# Altium project Pedal_Codec_4x4.PrjPcb
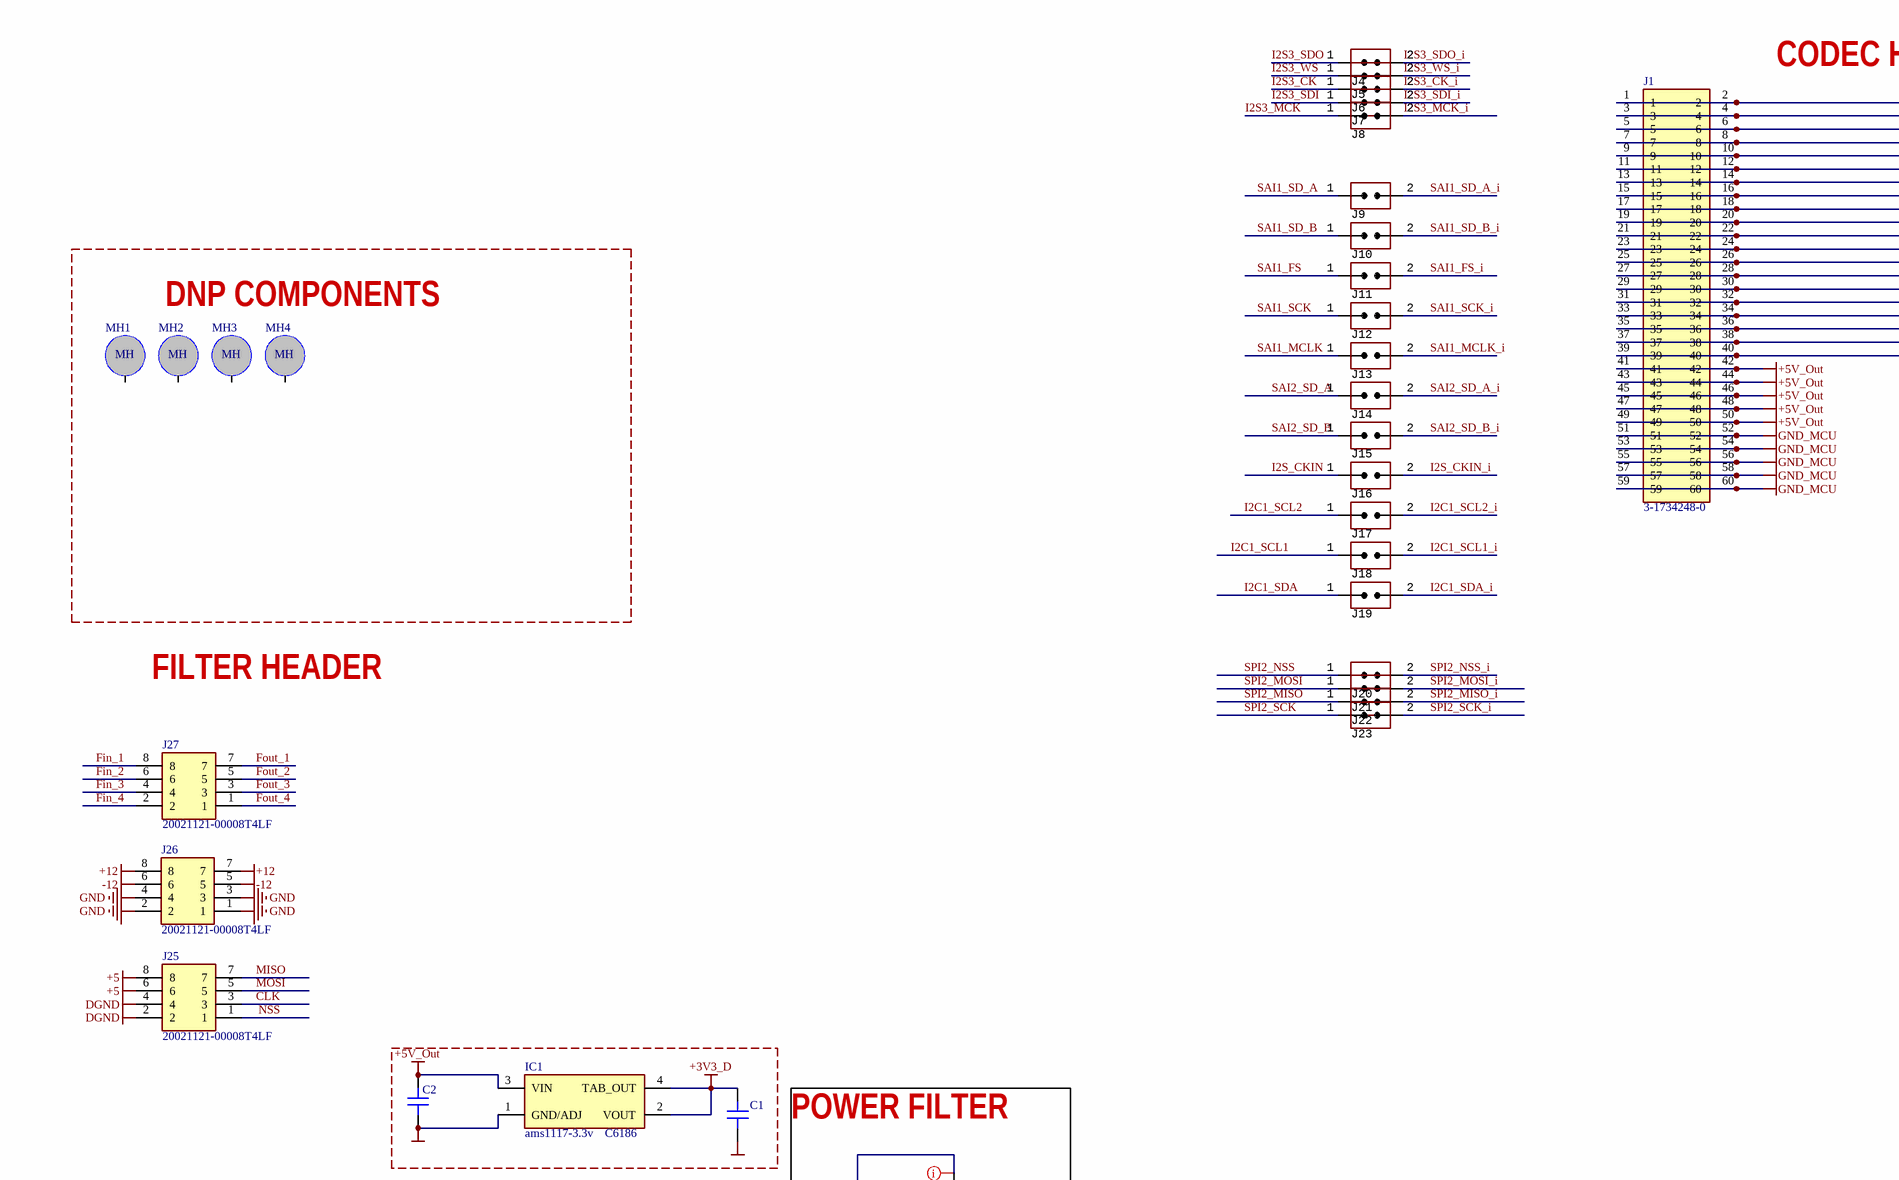
[diagram p0: SOM_Codec_WM8731.SchDoc, top left]
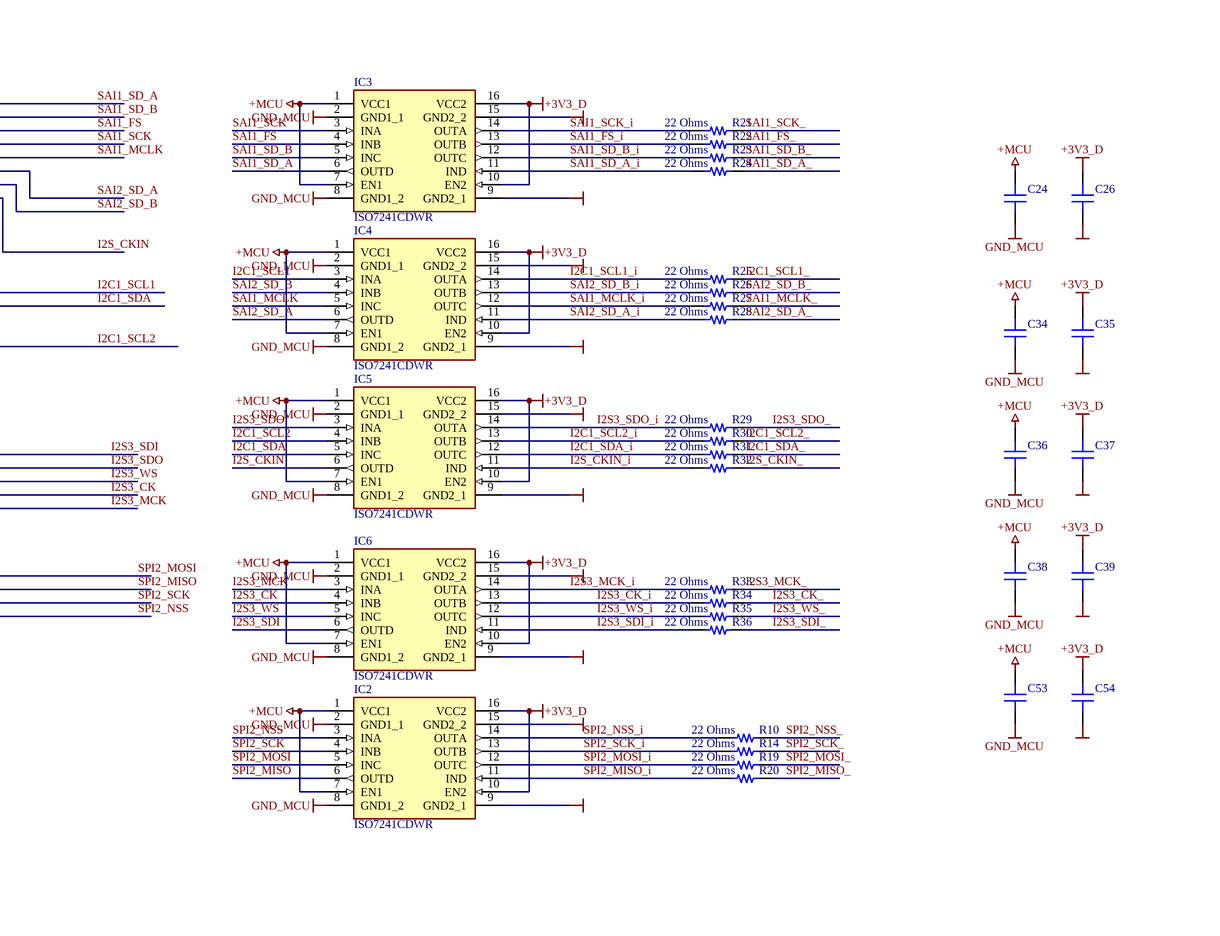
[diagram p1: SOM_Codec_WM8731.SchDoc, top right]
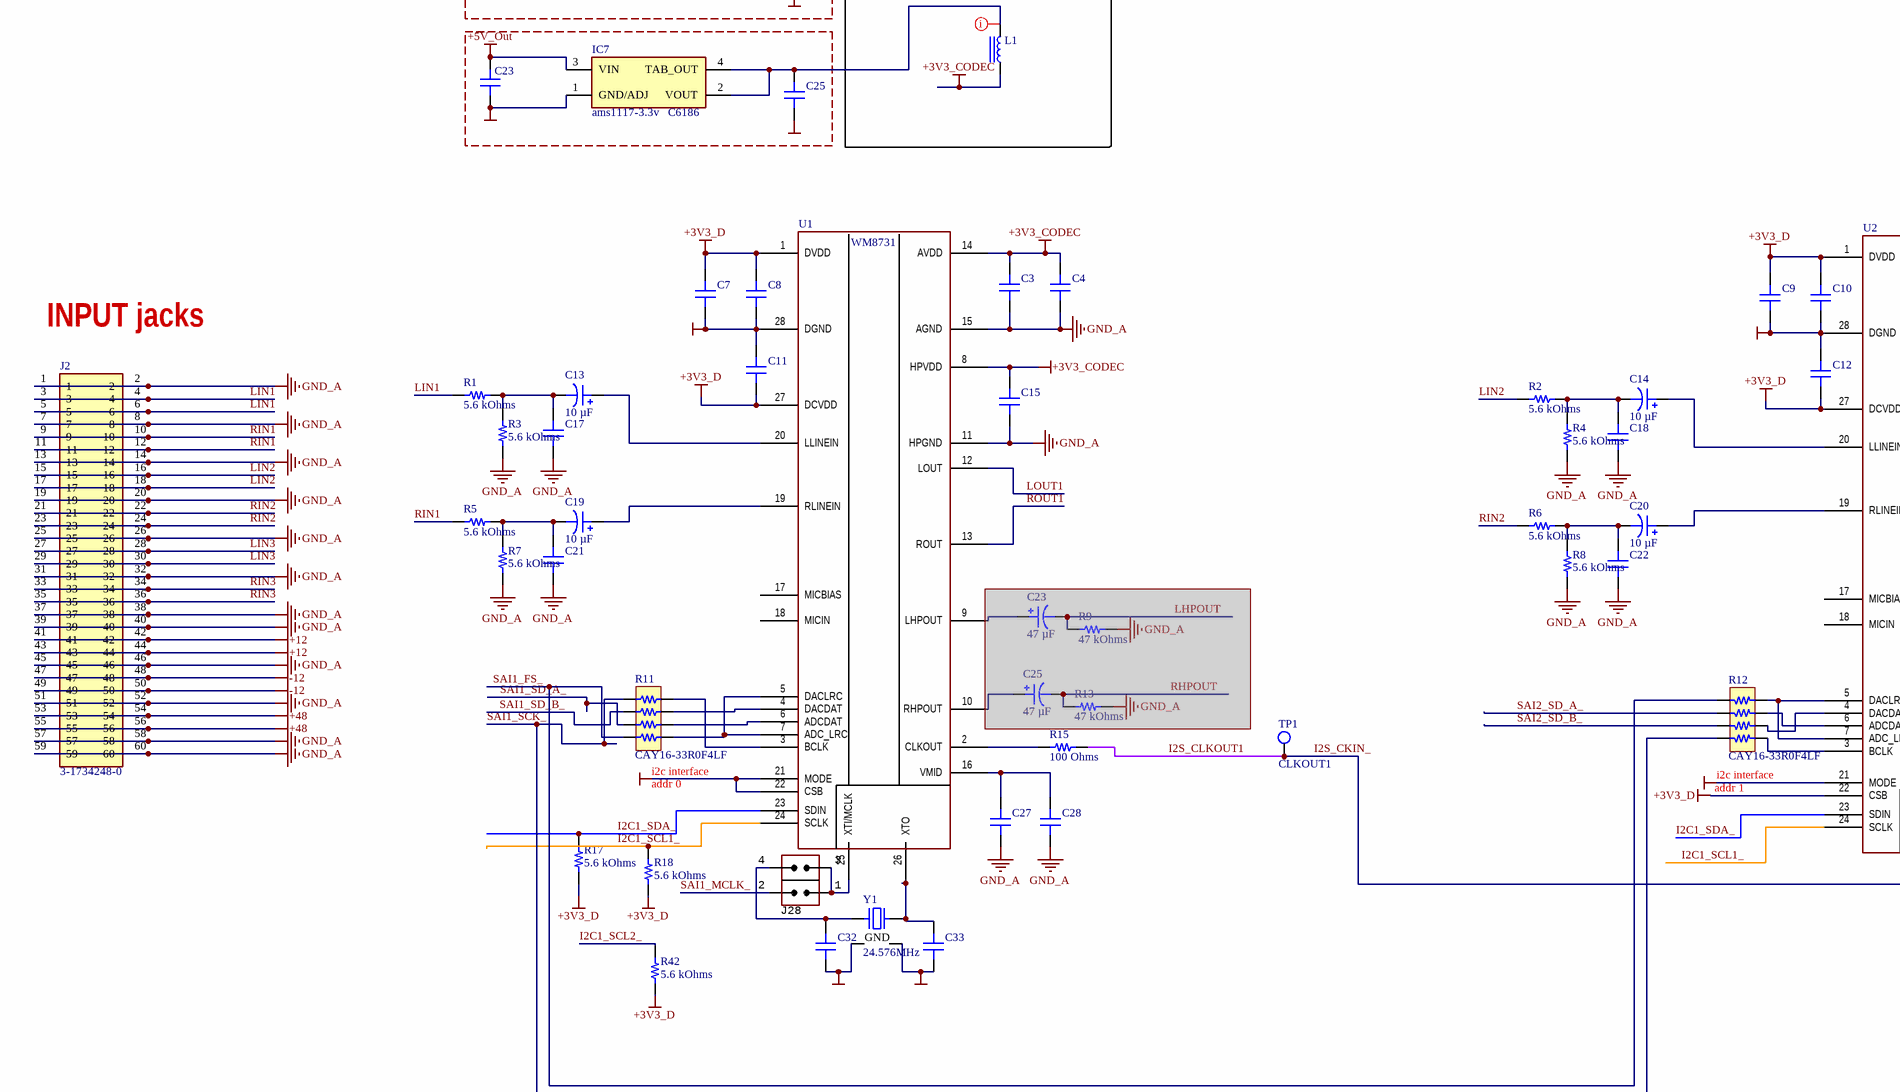
[diagram p2: SOM_Codec_WM8731.SchDoc, bottom left]
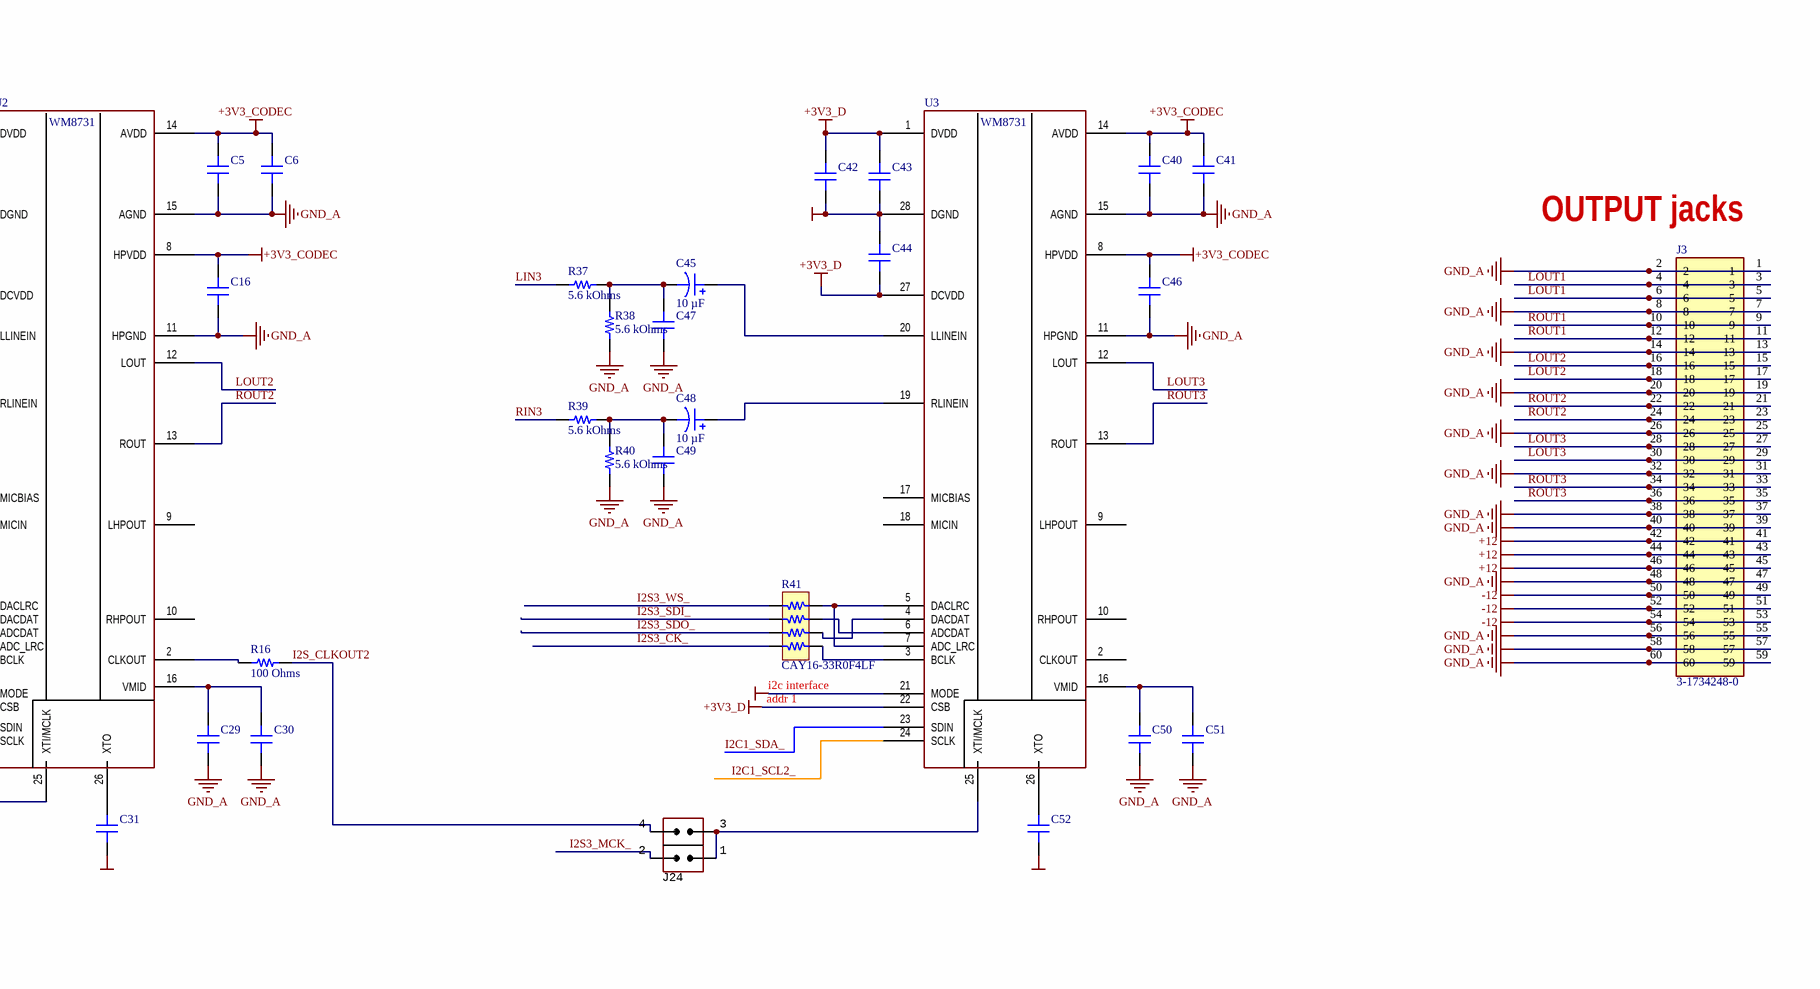
[diagram p3: SOM_Codec_WM8731.SchDoc, bottom right]
1 sheet, 143 parts. Net scope: global (net labels, ports and power ports of the same name join across sheets).
Board file: SOM_Codec_WM8731.PcbDoc

## Sheet SOM_Codec_WM8731.SchDoc
size A1; SheetNumber: 1; SheetTotal: 1

### Parts
(Parts that share a designator on the sheet are numbered #1, #2 ... from top to bottom, then left to right.)
C1  (no value)  [CAP 0805_2012]
C2  (no value)  [CAP 0805_2012]
C3  (no value)  [CAP 0402_1005]
C4  (no value)  [CAP 0805_2012]
C5  (no value)  [CAP 0402_1005]
C6  (no value)  [CAP 0805_2012]
C7  (no value)  [CAP 0805_2012]
C8  (no value)  [CAP 0402_1005]
C9  (no value)  [CAP 0805_2012]
C10  (no value)  [CAP 0402_1005]
C11  (no value)  [CAP 0402_1005]
C12  (no value)  [CAP 0402_1005]
C13  10 µF  [CAP POL 1206_3216]
C14  10 µF  [CAP POL 1206_3216]
C15  (no value)  [CAP 0402_1005]
C16  (no value)  [CAP 0402_1005]
C17  (no value)  [CAP 0603_1608]
C18  (no value)  [CAP 0603_1608]
C19  10 µF  [CAP POL 1206_3216]
C20  10 µF  [CAP POL 1206_3216]
C21  (no value)  [CAP 0603_1608]
C22  (no value)  [CAP 0603_1608]
C23#1  (no value)  [CAP 0805_2012]
C23#2  47 µF  [CAP POL 2917_7343]  (masked out: inside a compile mask, not in the netlist)
C24  (no value)  [CAP 0603_1608]
C25#1  (no value)  [CAP 0805_2012]
C25#2  47 µF  [CAP POL 2917_7343]  (masked out: inside a compile mask, not in the netlist)
C26  (no value)  [CAP 0603_1608]
C27  (no value)  [CAP 0402_1005]
C28  (no value)  [CAP 0805_2012]
C29  (no value)  [CAP 0402_1005]
C30  (no value)  [CAP 0805_2012]
C31  (no value)  [CAP 0805_2012]
C32  (no value)  [CAP 0805_2012]
C33  (no value)  [CAP 0805_2012]
C34  (no value)  [CAP 0603_1608]
C35  (no value)  [CAP 0603_1608]
C36  (no value)  [CAP 0603_1608]
C37  (no value)  [CAP 0603_1608]
C38  (no value)  [CAP 0603_1608]
C39  (no value)  [CAP 0603_1608]
C40  (no value)  [CAP 0402_1005]
C41  (no value)  [CAP 0805_2012]
C42  (no value)  [CAP 0805_2012]
C43  (no value)  [CAP 0402_1005]
C44  (no value)  [CAP 0402_1005]
C45  10 µF  [CAP POL 1206_3216]
C46  (no value)  [CAP 0402_1005]
C47  (no value)  [CAP 0603_1608]
C48  10 µF  [CAP POL 1206_3216]
C49  (no value)  [CAP 0603_1608]
C50  (no value)  [CAP 0402_1005]
C51  (no value)  [CAP 0805_2012]
C52  (no value)  [CAP 0805_2012]
C53  (no value)  [CAP 0603_1608]
C54  (no value)  [CAP 0603_1608]
IC1  ams1117-3.3v  Supplier Part Number 1: C6186  [SOT-223]
IC2  ISO7241CDWR  [SOIC127P1030X265-16N]
IC3  ISO7241CDWR  [SOIC127P1030X265-16N]
IC4  ISO7241CDWR  [SOIC127P1030X265-16N]
IC5  ISO7241CDWR  [SOIC127P1030X265-16N]
IC6  ISO7241CDWR  [SOIC127P1030X265-16N]
IC7  ams1117-3.3v  Supplier Part Number 1: C6186  [SOT-223]
J1  3-1734248-0  [317342480]
J2  3-1734248-0  [317342480]
J3  3-1734248-0  [317342480]
J4  (no value)  [CON: JUMPER x1]
J5  (no value)  [CON: JUMPER x1]
J6  (no value)  [CON: JUMPER x1]
J7  (no value)  [CON: JUMPER x1]
J8  (no value)  [CON: JUMPER x1]
J9  (no value)  [CON: JUMPER x1]
J10  (no value)  [CON: JUMPER x1]
J11  (no value)  [CON: JUMPER x1]
J12  (no value)  [CON: JUMPER x1]
J13  (no value)  [CON: JUMPER x1]
J14  (no value)  [CON: JUMPER x1]
J15  (no value)  [CON: JUMPER x1]
J16  (no value)  [CON: JUMPER x1]
J17  (no value)  [CON: JUMPER x1]
J18  (no value)  [CON: JUMPER x1]
J19  (no value)  [CON: JUMPER x1]
J20  (no value)  [CON: JUMPER x1]
J21  (no value)  [CON: JUMPER x1]
J22  (no value)  [CON: JUMPER x1]
J23  (no value)  [CON: JUMPER x1]
J24  (no value)  [CON: JUMPER x2]
J25  20021121-00008T4LF  [2002112100008T4LF]
J26  20021121-00008T4LF  [2002112100008T4LF]
J27  20021121-00008T4LF  [2002112100008T4LF]
J28  (no value)  [CON: JUMPER x2]
L1  (no value)  [BOURNS SRR6028]
MH1  MountingHole  [Hole_2.5mm]  (value not drawn)
MH2  MountingHole  [Hole_2.5mm]  (value not drawn)
MH3  MountingHole  [Hole_2.5mm]  (value not drawn)
MH4  MountingHole  [Hole_2.5mm]  (value not drawn)
R1  5.6 kOhms  [RES 0603_1608]
R2  5.6 kOhms  [RES 0603_1608]
R3  5.6 kOhms  [RES 0603_1608]
R4  5.6 kOhms  [RES 0603_1608]
R5  5.6 kOhms  [RES 0603_1608]
R6  5.6 kOhms  [RES 0603_1608]
R7  5.6 kOhms  [RES 0603_1608]
R8  5.6 kOhms  [RES 0603_1608]
R9  47 kOhms  [RES 0603_1608]  (masked out: inside a compile mask, not in the netlist)
R10  22 Ohms  [YAGEO RES 0402_1005]
R11  CAY16-33R0F4LF  [RESNET 1206-8 CONVEX]
R12  CAY16-33R0F4LF  [RESNET 1206-8 CONVEX]
R13  47 kOhms  [RES 0603_1608]  (masked out: inside a compile mask, not in the netlist)
R14  22 Ohms  [YAGEO RES 0402_1005]
R15  100 Ohms  [RES 0402_1005]
R16  100 Ohms  [RES 0402_1005]
R17  5.6 kOhms  [RES 0603_1608]
R18  5.6 kOhms  [RES 0603_1608]
R19  22 Ohms  [YAGEO RES 0402_1005]
R20  22 Ohms  [YAGEO RES 0402_1005]
R21  22 Ohms  [YAGEO RES 0402_1005]
R22  22 Ohms  [YAGEO RES 0402_1005]
R23  22 Ohms  [YAGEO RES 0402_1005]
R24  22 Ohms  [YAGEO RES 0402_1005]
R25  22 Ohms  [YAGEO RES 0402_1005]
R26  22 Ohms  [YAGEO RES 0402_1005]
R27  22 Ohms  [YAGEO RES 0402_1005]
R28  22 Ohms  [YAGEO RES 0402_1005]
R29  22 Ohms  [YAGEO RES 0402_1005]
R30  22 Ohms  [YAGEO RES 0402_1005]
R31  22 Ohms  [YAGEO RES 0402_1005]
R32  22 Ohms  [YAGEO RES 0402_1005]
R33  22 Ohms  [YAGEO RES 0402_1005]
R34  22 Ohms  [YAGEO RES 0402_1005]
R35  22 Ohms  [YAGEO RES 0402_1005]
R36  22 Ohms  [YAGEO RES 0402_1005]
R37  5.6 kOhms  [RES 0603_1608]
R38  5.6 kOhms  [RES 0603_1608]
R39  5.6 kOhms  [RES 0603_1608]
R40  5.6 kOhms  [RES 0603_1608]
R41  CAY16-33R0F4LF  [RESNET 1206-8 CONVEX]
R42  5.6 kOhms  [RES 0603_1608]
TP1  CLKOUT1  [TESTPOINT]  (no BOM)
U1  WM8731  [TSSOP-28]
U2  WM8731  [TSSOP-28]
U3  WM8731  [TSSOP-28]
Y1  24.576MHz  [ABRACON ABM8G]

### Blocks framed on the sheet
DNP COMPONENTS: MH1-MH4
POWER FILTER: L1

### Nets
+3V3_CODEC: C3.2 C4.2 C5.2 C6.2 C15.2 C16.2 C40.2 C41.2 C46.2 L1.1 U1.8(HPVDD) U1.14(AVDD) U2.8(HPVDD) U2.14(AVDD) U3.8(HPVDD) U3.14(AVDD)
+3V3_D: C1.2 C7.2 C8.2 C9.2 C10.2 C11.1 C12.1 C26.2 C35.2 C37.2 C39.2 C42.2 C43.2 C44.1 C54.2 IC1.2(VOUT) IC1.4(TAB_OUT) IC2.10(EN2) IC2.16(VCC2) IC3.10(EN2) IC3.16(VCC2) IC4.10(EN2) IC4.16(VCC2) IC5.10(EN2) IC5.16(VCC2) IC6.10(EN2) IC6.16(VCC2) R17.1 R18.1 R42.1 U1.1(DVDD) U1.27(DCVDD) U2.1(DVDD) U2.22(CSB) U2.27(DCVDD) U3.1(DVDD) U3.22(CSB) U3.27(DCVDD)
+5: J25.6 J25.8
+5V_Out: C2.2 C23#1.2 IC1.3(VIN) IC7.3(VIN) J1.41 J1.42 J1.43 J1.44 J1.45 J1.46 J1.47 J1.48 J1.49 J1.50
+12: J2.41 J2.42 J2.43 J2.44 J3.41 J3.42 J3.43 J3.44 J3.45 J3.46 J26.7 J26.8
+48: J2.53 J2.54 J2.55 J2.56
+MCU: C24.2 C34.2 C36.2 C38.2 C53.2 IC2.1(VCC1) IC2.7(EN1) IC3.1(VCC1) IC3.7(EN1) IC4.1(VCC1) IC4.7(EN1) IC5.1(VCC1) IC5.7(EN1) IC6.1(VCC1) IC6.7(EN1)
-12: J2.47 J2.48 J2.49 J2.50 J3.49 J3.50 J3.51 J3.52 J3.53 J3.54 J26.5 J26.6
DGND: J25.2 J25.4
GND: C1.1 C2.1 C7.1 C8.1 C9.1 C10.1 C11.2 C12.2 C23#1.1 C25#1.1 C26.1 C31.2 C32.2 C33.2 C35.1 C37.1 C39.1 C42.1 C43.1 C44.2 C52.2 C54.1 IC1.1(GND/ADJ) IC2.9(GND2_1) IC2.15(GND2_2) IC3.9(GND2_1) IC3.15(GND2_2) IC4.9(GND2_1) IC4.15(GND2_2) IC5.9(GND2_1) IC5.15(GND2_2) IC6.9(GND2_1) IC6.15(GND2_2) IC7.1(GND/ADJ) J26.1 J26.2 J26.3 J26.4 U1.21(MODE) U1.22(CSB) U1.28(DGND) U2.21(MODE) U2.28(DGND) U3.21(MODE) U3.28(DGND) Y1.2(GND) Y1.4(GND)
GND_A: C3.1 C4.1 C5.1 C6.1 C15.1 C16.1 C17.1 C18.1 C21.1 C22.1 C27.2 C28.2 C29.2 C30.2 C40.1 C41.1 C46.1 C47.1 C49.1 C50.2 C51.2 J2.1 J2.2 J2.7 J2.8 J2.13 J2.14 J2.19 J2.20 J2.25 J2.26 J2.31 J2.32 J2.37 J2.38 J2.39 J2.40 J2.45 J2.46 J2.51 J2.52 J2.57 J2.58 J2.59 J2.60 J3.1 J3.2 J3.7 J3.8 J3.13 J3.14 J3.19 J3.20 J3.25 J3.26 J3.31 J3.32 J3.37 J3.38 J3.39 J3.40 J3.47 J3.48 J3.55 J3.56 J3.57 J3.58 J3.59 J3.60 R3.1 R4.1 R7.1 R8.1 R38.1 R40.1 U1.11(HPGND) U1.15(AGND) U2.11(HPGND) U2.15(AGND) U3.11(HPGND) U3.15(AGND)
GND_MCU: C24.1 C34.1 C36.1 C38.1 C53.1 IC2.2(GND1_1) IC2.8(GND1_2) IC3.2(GND1_1) IC3.8(GND1_2) IC4.2(GND1_1) IC4.8(GND1_2) IC5.2(GND1_1) IC5.8(GND1_2) IC6.2(GND1_1) IC6.8(GND1_2) J1.51 J1.52 J1.53 J1.54 J1.55 J1.56 J1.57 J1.58 J1.59 J1.60
CLK: J25.3
Fin_1: J27.8
Fin_2: J27.6
Fin_3: J27.4
Fin_4: J27.2
Fout_1: J27.7
Fout_2: J27.5
Fout_3: J27.3
Fout_4: J27.1
I2C1_SCL1: IC4.3(INA) J1.17 J1.18 J18.1(IN)
I2C1_SCL1_: R18.2 R25.2 U1.24(SCLK) U2.24(SCLK)
I2C1_SCL1_i: IC4.14(OUTA) J18.2(IN) R25.1
I2C1_SCL2: IC5.4(INB) J1.21 J1.22 J17.1(IN)
I2C1_SCL2_: R30.2 R42.2 U3.24(SCLK)
I2C1_SCL2_i: IC5.13(OUTB) J17.2(IN) R30.1
I2C1_SDA: IC5.5(INC) J1.19 J1.20 J19.1(IN)
I2C1_SDA_: R17.2 R31.2 U1.23(SDIN) U2.23(SDIN) U3.23(SDIN)
I2C1_SDA_i: IC5.12(OUTC) J19.2(IN) R31.1
I2S3_CK: IC6.4(INB) J1.29 J1.30 J6.1(IN)
I2S3_CK_: R34.2 R41.5
I2S3_CK_i: IC6.13(OUTB) J6.2(IN) R34.1
I2S3_MCK: IC6.3(INA) J1.31 J1.32 J8.1(IN)
I2S3_MCK_: J24.2(IN) R33.2
I2S3_MCK_i: IC6.14(OUTA) J8.2(IN) R33.1
I2S3_SDI: IC6.6(OUTD) J1.23 J1.24 J7.1(IN)
I2S3_SDI_: R36.2 R41.7
I2S3_SDI_i: IC6.11(IND) J7.2(IN) R36.1
I2S3_SDO: IC5.3(INA) J1.25 J1.26 J4.1(IN)
I2S3_SDO_: R29.2 R41.6
I2S3_SDO_i: IC5.14(OUTA) J4.2(IN) R29.1
I2S3_WS: IC6.5(INC) J1.27 J1.28 J5.1(IN)
I2S3_WS_: R35.2 R41.8
I2S3_WS_i: IC6.12(OUTC) J5.2(IN) R35.1
I2S_CKIN: IC5.6(OUTD) J1.15 J1.16 J16.1(IN)
I2S_CKIN_: R15.2 R32.2 TP1.1 U2.25(XTI/MCLK)  [also labelled I2S_CLKOUT1]
I2S_CKIN_i: IC5.11(IND) J16.2(IN) R32.1
I2S_CLKOUT2: J24.4(IN) R16.2
LIN1: J2.3 J2.4 J2.5 J2.6 R1.1
LIN2: J2.15 J2.16 J2.17 J2.18 R2.1
LIN3: J2.27 J2.28 J2.29 J2.30 R37.1
LOUT1: J3.3 J3.4 J3.5 J3.6 U1.12(LOUT)
LOUT2: J3.15 J3.16 J3.17 J3.18 U2.12(LOUT)
LOUT3: J3.27 J3.28 J3.29 J3.30 U3.12(LOUT)
MISO: J25.7
MOSI: J25.5
NSS: J25.1
RIN1: J2.9 J2.10 J2.11 J2.12 R5.1
RIN2: J2.21 J2.22 J2.23 J2.24 R6.1
RIN3: J2.33 J2.34 J2.35 J2.36 R39.1
ROUT1: J3.9 J3.10 J3.11 J3.12 U1.13(ROUT)
ROUT2: J3.21 J3.22 J3.23 J3.24 U2.13(ROUT)
ROUT3: J3.33 J3.34 J3.35 J3.36 U3.13(ROUT)
SAI1_FS: IC3.4(INB) J1.5 J1.6 J11.1(IN)
SAI1_FS_: R11.4 R12.8 R22.2
SAI1_FS_i: IC3.13(OUTB) J11.2(IN) R22.1
SAI1_MCLK: IC4.5(INC) J1.9 J1.10 J13.1(IN)
SAI1_MCLK_: J28.2(IN) R27.2
SAI1_MCLK_i: IC4.12(OUTC) J13.2(IN) R27.1
SAI1_SCK: IC3.3(INA) J1.7 J1.8 J12.1(IN)
SAI1_SCK_: R11.1 R12.5 R21.2
SAI1_SCK_i: IC3.14(OUTA) J12.2(IN) R21.1
SAI1_SD_A: IC3.6(OUTD) J1.1 J1.2 J9.1(IN)
SAI1_SD_A_: R11.3 R24.2
SAI1_SD_A_i: IC3.11(IND) J9.2(IN) R24.1
SAI1_SD_B: IC3.5(INC) J1.3 J1.4 J10.1(IN)
SAI1_SD_B_: R11.2 R23.2
SAI1_SD_B_i: IC3.12(OUTC) J10.2(IN) R23.1
SAI2_SD_A: IC4.6(OUTD) J1.11 J1.12 J14.1(IN)
SAI2_SD_A_: R12.7 R28.2
SAI2_SD_A_i: IC4.11(IND) J14.2(IN) R28.1
SAI2_SD_B: IC4.4(INB) J1.13 J1.14 J15.1(IN)
SAI2_SD_B_: R12.6 R26.2
SAI2_SD_B_i: IC4.13(OUTB) J15.2(IN) R26.1
SPI2_MISO: IC2.6(OUTD) J1.35 J1.36 J22.1(IN)
SPI2_MISO_: R20.2
SPI2_MISO_i: IC2.11(IND) J22.2(IN) R20.1
SPI2_MOSI: IC2.5(INC) J1.33 J1.34 J21.1(IN)
SPI2_MOSI_: R19.2
SPI2_MOSI_i: IC2.12(OUTC) J21.2(IN) R19.1
SPI2_NSS: IC2.3(INA) J1.39 J1.40 J20.1(IN)
SPI2_NSS_: R10.2
SPI2_NSS_i: IC2.14(OUTA) J20.2(IN) R10.1
SPI2_SCK: IC2.4(INB) J1.37 J1.38 J23.1(IN)
SPI2_SCK_: R14.2
SPI2_SCK_i: IC2.13(OUTB) J23.2(IN) R14.1
NetC13_1: C13.1 U1.20(LLINEIN)
NetC13_2: C13.2 C17.2 R1.2 R3.2
NetC14_1: C14.1 U2.20(LLINEIN)
NetC14_2: C14.2 C18.2 R2.2 R4.2
NetC19_1: C19.1 U1.19(RLINEIN)
NetC19_2: C19.2 C21.2 R5.2 R7.2
NetC20_1: C20.1 U2.19(RLINEIN)
NetC20_2: C20.2 C22.2 R6.2 R8.2
NetC25#1_2: C25#1.2 IC7.2(VOUT) IC7.4(TAB_OUT) L1.2
NetC27_1: C27.1 C28.1 U1.16(VMID)
NetC29_1: C29.1 C30.1 U2.16(VMID)
NetC31_1: C31.1 U2.26(XTO)
NetC32_1: C32.1 J28.4(IN) Y1.1
NetC33_1: C33.1 U1.26(XTO) Y1.3
NetC45_1: C45.1 U3.20(LLINEIN)
NetC45_2: C45.2 C47.2 R37.2 R38.2
NetC48_1: C48.1 U3.19(RLINEIN)
NetC48_2: C48.2 C49.2 R39.2 R40.2
NetC50_1: C50.1 C51.1 U3.16(VMID)
NetC52_1: C52.1 U3.26(XTO)
NetJ24_1: J24.1(IN) J24.3(IN) U3.25(XTI/MCLK)
NetJ28_1: J28.1(IN) J28.3(IN) U1.25(XTI/MCLK)
NetR11_5: R11.5 U1.5(DACLRC) U1.7(ADC_LRC)
NetR11_6: R11.6 U1.6(ADCDAT)
NetR11_7: R11.7 U1.4(DACDAT)
NetR11_8: R11.8 U1.3(BCLK)
NetR12_1: R12.1 U2.5(DACLRC) U2.7(ADC_LRC)
NetR12_2: R12.2 U2.6(ADCDAT)
NetR12_3: R12.3 U2.4(DACDAT)
NetR12_4: R12.4 U2.3(BCLK)
NetR15_1: R15.1 U1.2(CLKOUT)
NetR16_1: R16.1 U2.2(CLKOUT)
NetR41_1: R41.1 U3.5(DACLRC) U3.7(ADC_LRC)
NetR41_2: R41.2 U3.6(ADCDAT)
NetR41_3: R41.3 U3.4(DACDAT)
NetR41_4: R41.4 U3.3(BCLK)

Not connected (* = marked no-connect by the designer): MH1 0; MH2 0; MH3 0; MH4 0; U1 9(LHPOUT) 10(RHPOUT) 17(MICBIAS) 18(MICIN); U2 9(LHPOUT) 10(RHPOUT) 17(MICBIAS) 18(MICIN); U3 2(CLKOUT) 9(LHPOUT) 10(RHPOUT) 17(MICBIAS) 18(MICIN)

### Layout directives
net class PowerNet: NetC25#1_2

### Notes on the sheet
- CODEC HEADER
- FILTER HEADER
- INPUT jacks
- (near J3) OUTPUT jacks
- (near R11) i2c interface
- (near R11) addr 0
- (near R12) addr 1
- (near R12) i2c interface
- (near R41) addr 1
- (near R41) i2c interface
- (in symbol MountingHole) MH

### Library data of the parts
C1 C4 C6 C7 C9 C25#1 C28 C30 C41 C42 C51 = LMK212ABJ106KD-T: CAP CER 10UF 10V X5R 0805; Capacitance: 10 µF; Part Number: LMK212ABJ106KD-T
C2 C23#1 = EMK212B7105KGHTR: CAP CER 1UF 16V X7R 0805; Capacitance: 1 µF; Part Number: EMK212B7105KGHTR
C3 C5 C8 C10-C12 C15 C16 C27 C29 C40 C43 C44 C46 C50 = CL05B104JO5NNNC: CAP CER 0.1UF 16V X7R 0402; Capacitance: 0.1 µF; Part Number: CL05B104JO5NNNC
C13 C14 C19 C20 C45 C48 = TR3A106K010C2000: CAP TANT 10UF 10% 10V 1206; Part Number: TR3A106K010C2000; Value: 10 µF
C17 C18 C21 C22 C47 C49 = CC0603JRX7R9BB221: CAP CER 220PF 50V X7R 0603; Part Number: CC0603JRX7R9BB221; Capacitance: 220 pF
C23#2 C25#2 = T495D476K010ATE090: CAP TANT 47UF 10% 10V 2917; Part Number: T495D476K010ATE090; Value: 47 µF
C24 C26 C34-C39 C53 C54 = 06035C104MAT2A: CAP CER 0.1UF 50V X7R 0603; Capacitance: 0.1µF; Part Number: 06035C104MAT2A
C31-C33 C52 = CBR08C909BAGAC: CAP CER 9PF 250V C0G/NP0 0805; Part Number: CBR08C909BAGAC; Capacitance: 9 pF
IC1 IC7 = ams1117-3.3v: Integrated Circuit; Manufacturer_Name: Advanced Monolithic Systems; Datasheet Link: http://www.advanced-monolithic.com/pdf/ds1117.pdf; Height: 1.8mm; Manufacturer_Part_Number: ams1117-3.3v; Supplier 1: LCSC
IC2-IC6 = ISO7241CDWR: Integrated Circuit; Manufacturer_Name: Texas Instruments; Datasheet Link: http://www.ti.com/lit/gpn/iso7241c; Height: 2.65mm; Manufacturer_Part_Number: ISO7241CDWR; Mouser Part Number: 595-ISO7241CDWR; Mouser Price/Stock: https://www.mouser.co.uk/ProductDetail/Texas-Instruments/ISO7241CDWR?qs=LDGDZb5k%2F%252B%2FseN2cNP%252BcHQ%3D%3D; Arrow Part Number: ISO7241CDWR; Arrow Price/Stock: https://www.arrow.com/en/products/iso7241cdwr/texas-instruments?region=nac
J1-J3 = 3-1734248-0: Connector; Manufacturer_Name: TE Connectivity; Datasheet Link: https://www.te.com/commerce/DocumentDelivery/DDEController?Action=srchrtrv&DocNm=5-1773461-0_Standard_FPC_Connectors_QRG&DocType=Data%20Sheet&DocLang=English&PartCntxt=3-1734248-0&DocFormat=pdf; Height: 7.7mm; Manufacturer_Part_Number: 3-1734248-0; Mouser Part Number: 571-3-1734248-0; Mouser Price/Stock: https://www.mouser.co.uk/ProductDetail/TE-Connectivity/3-1734248-0?qs=rVE9j%252BL6g1a4TQRjUuGYiA%3D%3D; Arrow Part Number: 3-1734248-0; Arrow Price/Stock: https://www.arrow.com/en/products/3-1734248-0/te-connectivity; System: Connector
J4-J23 = Jumper_single: CommentText: "Перемычка"
J24 J28 = Jumper_double: CommentText: "Перемычка"
J25-J27 = 20021121-00008T4LF: Connector; Manufacturer_Name: Amphenol Communications Solutions; Datasheet Link: https://cdn.amphenol-cs.com/media/wysiwyg/files/drawing/20021121.pdf; Height: 4.55mm; Manufacturer_Part_Number: 20021121-00008T4LF; System: Connector
L1 = SRR6028-3R3Y: FIXED IND 3.3UH 2.5A 28 MOHM SMD; Manufacturer: Bourns Inc.; Current - Saturation: 2.6A; DC Resistance (DCR): 28mOhm Max; Frequency - Self Resonant: 45MHz; Inductance: 3.3 µH; Inductance Frequency - Test: 100 kHz; Material - Core: Ferrite; Q @ Freq: 10 @ 7.96MHz; Shielding: Shielded; Tolerance: ±30%; Type: Drum Core, Wirewound; Value: 3.3 µH; Part Number: SRR6028-3R3Y; ComponentLink1Description: Datasheet; ComponentLink1URL: https://www.bourns.com/docs/Product-Datasheets/SRR6028.pdf; ComponentLink2Description: DigiKey Link; ComponentLink2URL: https://www.digikey.com/en/products/detail/bourns-inc/SRR6028-3R3Y/1970369; Current Rating (Amps): 2.5 A; Device Package: Nonstandard; Height - Seated (Max): 0.118" (3.00mm); LastUpdated: 2/8/2024 9:34:55 PM; Lifecycle Status: Active; Minimum Order: 1; Mounting Type: Surface Mount; Operating Temperature: -40°C ~ 125°C; Package / Case: Nonstandard; Packaging: TapeAndReel; PartId: 57; Part Status: Active; Price: 0.31; Series: SRR6028; Size / Dimension: 0.268" L x 0.268" W (6.80mm x 6.80mm); Supplier 1: DigiKey; Supplier Part Number 1: 118-SRR6028-3R3YCT-ND
R1-R8 R17 R18 R37-R40 R42 = RG1608P-562-D-T5: RES SMD 5.6K OHM 0.5% 1/10W 0603; Part Number: RG1608P-562-D-T5; Value: 5.6 kOhms
R9 R13 = RCA060347K0FKEA: RES SMD 47K OHM 1% 1/10W 0603; Part Number: RCA060347K0FKEA; Value: 47 kOhms
R10 R14 R19-R36 = RC0402JR-0722RL: RES 22 OHM 5% 1/16W 0402; Part Number: RC0402JR-0722RL; Value: 22 Ohms
R11 R12 R41 = CAY16-33R0F4LF: RES ARRAY 4 RES 33 OHM 1206; Part Number: CAY16-33R0F4LF
R15 R16 = RCA0402100RFKED: RES SMD 100 OHM 1% 1/16W 0402; Part Number: RCA0402100RFKED; Value: 100 Ohms
TP1 = TestPoint
U1-U3 = WM8731: Stero in/ot audio codec
Y1 = ABM8G-24.576MHZ-4Y-T3: CRYSTAL 24.5760MHZ 10PF SMD; Manufacturer: Abracon LLC; ESR (Equivalent Series Resistance): 60 Ohms; Frequency Stability: ±30ppm; Operating Mode: Fundamental; Part Number: ABM8G-24.576MHZ-4Y-T3; ComponentLink1Description: Datasheet; ComponentLink1URL: https://abracon.com/Resonators/ABM8G.pdf; ComponentLink2Description: DigiKey Link; ComponentLink2URL: http://digikey.com/product-detail/en/abracon-llc/ABM8G-24.576MHZ-4Y-T3/535-10914-1-ND/2624247; Device Package: 4-SMD, No Lead; Frequency: 24.576MHz; Frequency Tolerance: ±30ppm; Height - Seated (Max): 0.039" (1.00mm); LastUpdated: 3/19/2020 10:36:25 PM; Lifecycle Status: Active; Load Capacitance: 10pF; Minimum Order: 1; Mounting Type: Surface Mount; Operating Temperature: -10°C ~ 60°C; Package / Case: 4-SMD, No Lead; Packaging: TapeAndReel; PartId: 366; Part Status: Active; Price: 0.39; Series: ABM8G; Size / Dimension: 0.126" L x 0.098" W (3.20mm x 2.50mm); Supplier 1: DigiKey; Supplier Part Number 1: 535-10914-1-ND; Type: MHz Crystal; Value: 24.576MHz